# Altium schematic sheet eth.schdoc: ETH
size A4; Date: 10.02.2026; CheckedBy: BCY; DrawnBy: miaow; Revision: v1.0.0; SheetNumber: 12; SheetTotal: 18; BoardType: MAIN_PCB; Desc: 100Mbps ethernet
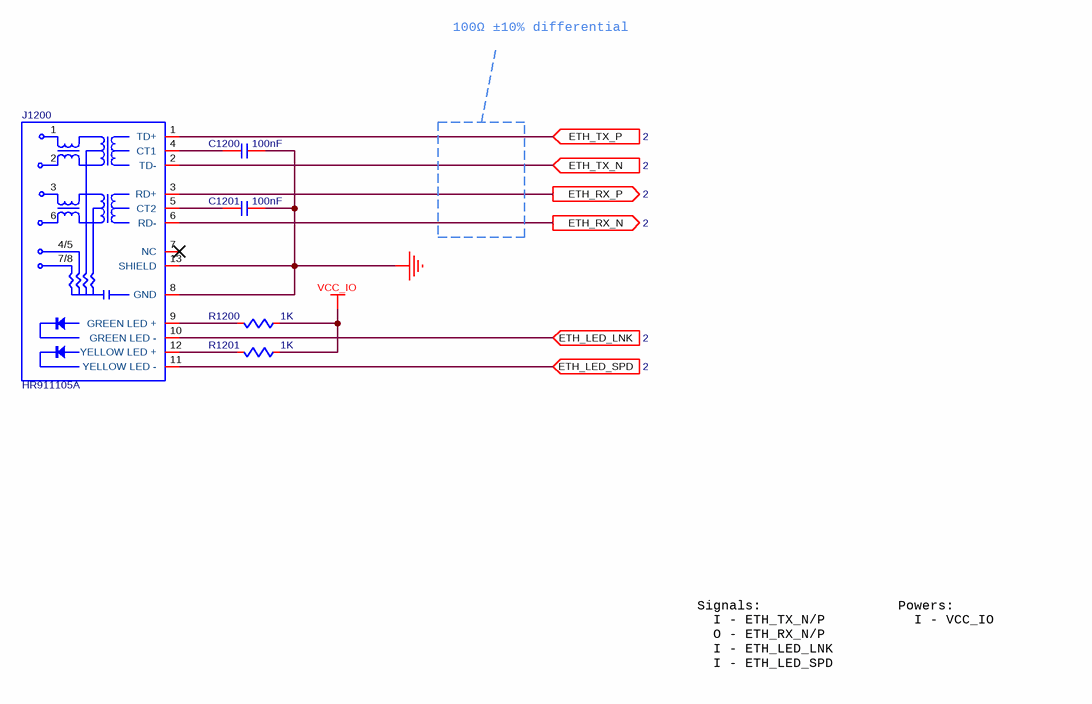
[diagram p0: eth.schdoc]

## Parts
C1200  value 100nF  [C0402]  (hidden comment: C-NOMO)
C1201  value 100nF  [C0402]  (hidden comment: C-NOMO)
J1200  HR911105A  [HR911105A]
R1200  value 1K  [R0402]  (hidden comment: R)
R1201  value 1K  [R0402]  (hidden comment: R)

## Ports
ETH_LED_LNK (in, see 2), ETH_LED_SPD (in, see 2), ETH_RX_N (out, see 2), ETH_RX_P (out, see 2), ETH_TX_N (in, see 2), ETH_TX_P (in, see 2)

## Nets
GND: C1200.1 C1201.1 J1200.8(GND) J1200.13(SHIELD)
VCC_IO: R1200.2 R1201.2
ETH_LED_LNK: J1200.10(GREEN_LED_-) ; port ETH_LED_LNK
ETH_LED_SPD: J1200.11(YELLOW_LED_-) ; port ETH_LED_SPD
ETH_RX_N: J1200.6(RD-) ; port ETH_RX_N
ETH_RX_P: J1200.3(RD+) ; port ETH_RX_P
ETH_TX_N: J1200.2(TD-) ; port ETH_TX_N
ETH_TX_P: J1200.1(TD+) ; port ETH_TX_P
NetC1200_2: C1200.2 J1200.4(CT1)
NetC1201_2: C1201.2 J1200.5(CT2)
NetJ1200_9: J1200.9(GREEN_LED_+) R1200.1
NetJ1200_12: J1200.12(YELLOW_LED_+) R1201.1

Not connected (* = marked no-connect by the designer): J1200 7(NC)*

## Notes on the sheet
- 100Ω ±10% differential
- Signals:
  I - ETH_TX_N/P
  O - ETH_RX_N/P
  I - ETH_LED_LNK
  I - ETH_LED_SPD
- Powers:
  I - VCC_IO
- DRAWN
- CHECKED
- DRAWNBY
- SHEETS
- SHEETS_NO
- (in symbol HR911105A) 4/5; 7/8

## Library data of the parts
C1200 C1201 = C-NOMO: voltage: 50V; precision: 5%; Supplier 1: LCSC; Supplier Part Number 1: C307331
J1200 = HR911105A: RJ45 - 100Mbps, Mag, LED; Supplier 1: LCSC; Supplier Part Number 1: C12074
R1200 R1201 = R: precision: 1%; Supplier 1: LCSC; Supplier Part Number 1: C11702